# Altium schematic sheet Connector.SchDoc
size A; DocumentNumber: 6; SheetNumber: 6
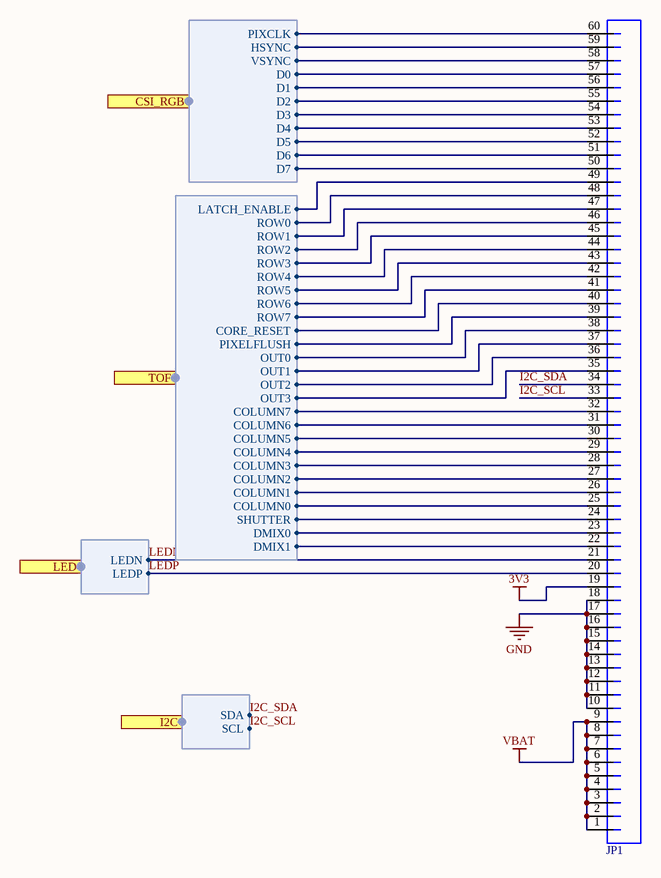
[diagram p0: Connector.SchDoc]

## Parts
JP1  JST_JMD_60_RECEPTACLE  [JST-JMD-60-SMD-RECEPTACLE]  (value not drawn)

## Ports
CSI_RGB (harness CSI), I2C (harness I2C), LED (harness LED), TOF (harness TOF)

## Harnesses
CSI: D2, D3, D1, D0, D6, D7, D5, D4, PIXCLK, HSYNC, VSYNC
LED: LEDP, LEDN
I2C: SCL, SDA
TOF: DMIX1, DMIX0, SHUTTER, COLUMN0, COLUMN1, COLUMN2, COLUMN4, COLUMN3, COLUMN5, COLUMN6, COLUMN7, LATCH_ENABLE, ROW0, ROW1, ROW2, ROW3, ROW4, ROW5, ROW6, ROW7, CORE_RESET, PIXELFLUSH, OUT0, OUT1, OUT2, OUT3

## Nets
3V3: JP1.19
GND: JP1.10 JP1.11 JP1.12 JP1.13 JP1.14 JP1.15 JP1.16 JP1.17 JP1.18
VBAT: JP1.1 JP1.2 JP1.3 JP1.4 JP1.5 JP1.6 JP1.7 JP1.8 JP1.9
I2C_SCL: JP1.33 ; port I2C.SCL
I2C_SDA: JP1.34 ; port I2C.SDA
LEDN: JP1.21 ; port LED.LEDN
LEDP: JP1.20 ; port LED.LEDP
NetJP1_22: JP1.22 ; port TOF.DMIX1
NetJP1_23: JP1.23 ; port TOF.DMIX0
NetJP1_24: JP1.24 ; port TOF.SHUTTER
NetJP1_25: JP1.25 ; port TOF.COLUMN0
NetJP1_26: JP1.26 ; port TOF.COLUMN1
NetJP1_27: JP1.27 ; port TOF.COLUMN2
NetJP1_28: JP1.28 ; port TOF.COLUMN3
NetJP1_29: JP1.29 ; port TOF.COLUMN4
NetJP1_30: JP1.30 ; port TOF.COLUMN5
NetJP1_31: JP1.31 ; port TOF.COLUMN6
NetJP1_32: JP1.32 ; port TOF.COLUMN7
NetJP1_35: JP1.35 ; port TOF.OUT3
NetJP1_36: JP1.36 ; port TOF.OUT2
NetJP1_37: JP1.37 ; port TOF.OUT1
NetJP1_38: JP1.38 ; port TOF.OUT0
NetJP1_39: JP1.39 ; port TOF.PIXELFLUSH
NetJP1_40: JP1.40 ; port TOF.CORE_RESET
NetJP1_41: JP1.41 ; port TOF.ROW7
NetJP1_42: JP1.42 ; port TOF.ROW6
NetJP1_43: JP1.43 ; port TOF.ROW5
NetJP1_44: JP1.44 ; port TOF.ROW4
NetJP1_45: JP1.45 ; port TOF.ROW3
NetJP1_46: JP1.46 ; port TOF.ROW2
NetJP1_47: JP1.47 ; port TOF.ROW1
NetJP1_48: JP1.48 ; port TOF.ROW0
NetJP1_49: JP1.49 ; port TOF.LATCH_ENABLE
NetJP1_50: JP1.50 ; port CSI_RGB.D7
NetJP1_51: JP1.51 ; port CSI_RGB.D6
NetJP1_52: JP1.52 ; port CSI_RGB.D5
NetJP1_53: JP1.53 ; port CSI_RGB.D4
NetJP1_54: JP1.54 ; port CSI_RGB.D3
NetJP1_55: JP1.55 ; port CSI_RGB.D2
NetJP1_56: JP1.56 ; port CSI_RGB.D1
NetJP1_57: JP1.57 ; port CSI_RGB.D0
NetJP1_58: JP1.58 ; port CSI_RGB.VSYNC
NetJP1_59: JP1.59 ; port CSI_RGB.HSYNC
NetJP1_60: JP1.60 ; port CSI_RGB.PIXCLK

## Library data of the parts
JP1 = JST_JMD_60_RECEPTACLE: Manufacturer: JST Sales America, Inc.; PartNumber: 60R-JMDSS-G-1-TF(S); PackageReference: JMD-60; Mounting Technology: Surface Mount